# Altium schematic sheet Board.SchDoc
size A4
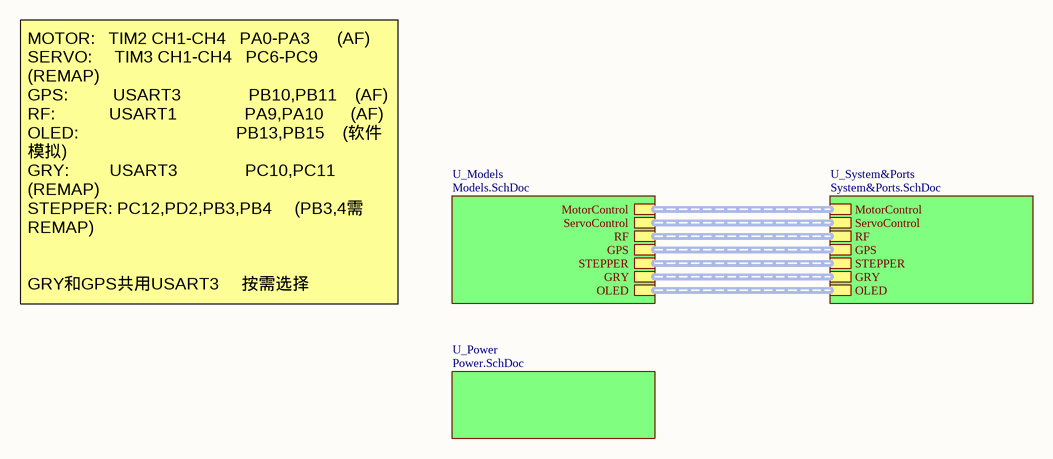
[diagram p0: Board.SchDoc]

## Sub-sheets
U_Models = Models.SchDoc: MotorControl (harness MOTOR), ServoControl (harness SERO), RF (harness RF), GPS (harness GPS), STEPPER (harness STEPPER), GRY (harness GRY), OLED (harness OLED)
U_Power = Power.SchDoc: no entries
U_System&Ports = System&Ports.SchDoc: MotorControl (harness MOTOR), ServoControl (harness SERO), RF (harness RF), GPS (harness GPS), STEPPER (harness STEPPER), GRY (harness GRY), OLED (harness OLED)

## Buses and harness runs
harness sheet U_Models/GPS = sheet U_System&Ports/GPS
harness sheet U_Models/GRY = sheet U_System&Ports/GRY
harness sheet U_Models/MotorControl = sheet U_System&Ports/MotorControl
harness sheet U_Models/OLED = sheet U_System&Ports/OLED
harness sheet U_Models/RF = sheet U_System&Ports/RF
harness sheet U_Models/ServoControl = sheet U_System&Ports/ServoControl
harness sheet U_Models/STEPPER = sheet U_System&Ports/STEPPER

## Notes on the sheet
- MOTOR:   TIM2 CH1-CH4   PA0-PA3      (AF)
  SERVO:     TIM3 CH1-CH4   PC6-PC9      (REMAP)
  GPS:          USART3               PB10,PB11    (AF)
  RF:            USART1               PA9,PA10      (AF)
  OLED:                                   PB13,PB15    (软件模拟)
  GRY:         USART3               PC10,PC11  (REMAP)
  STEPPER: PC12,PD2,PB3,PB4     (PB3,4需REMAP)
  GRY和GPS共用USART3     按需选择